# EAGLE schematic MT9V024 (EAGLE 9.1.2)
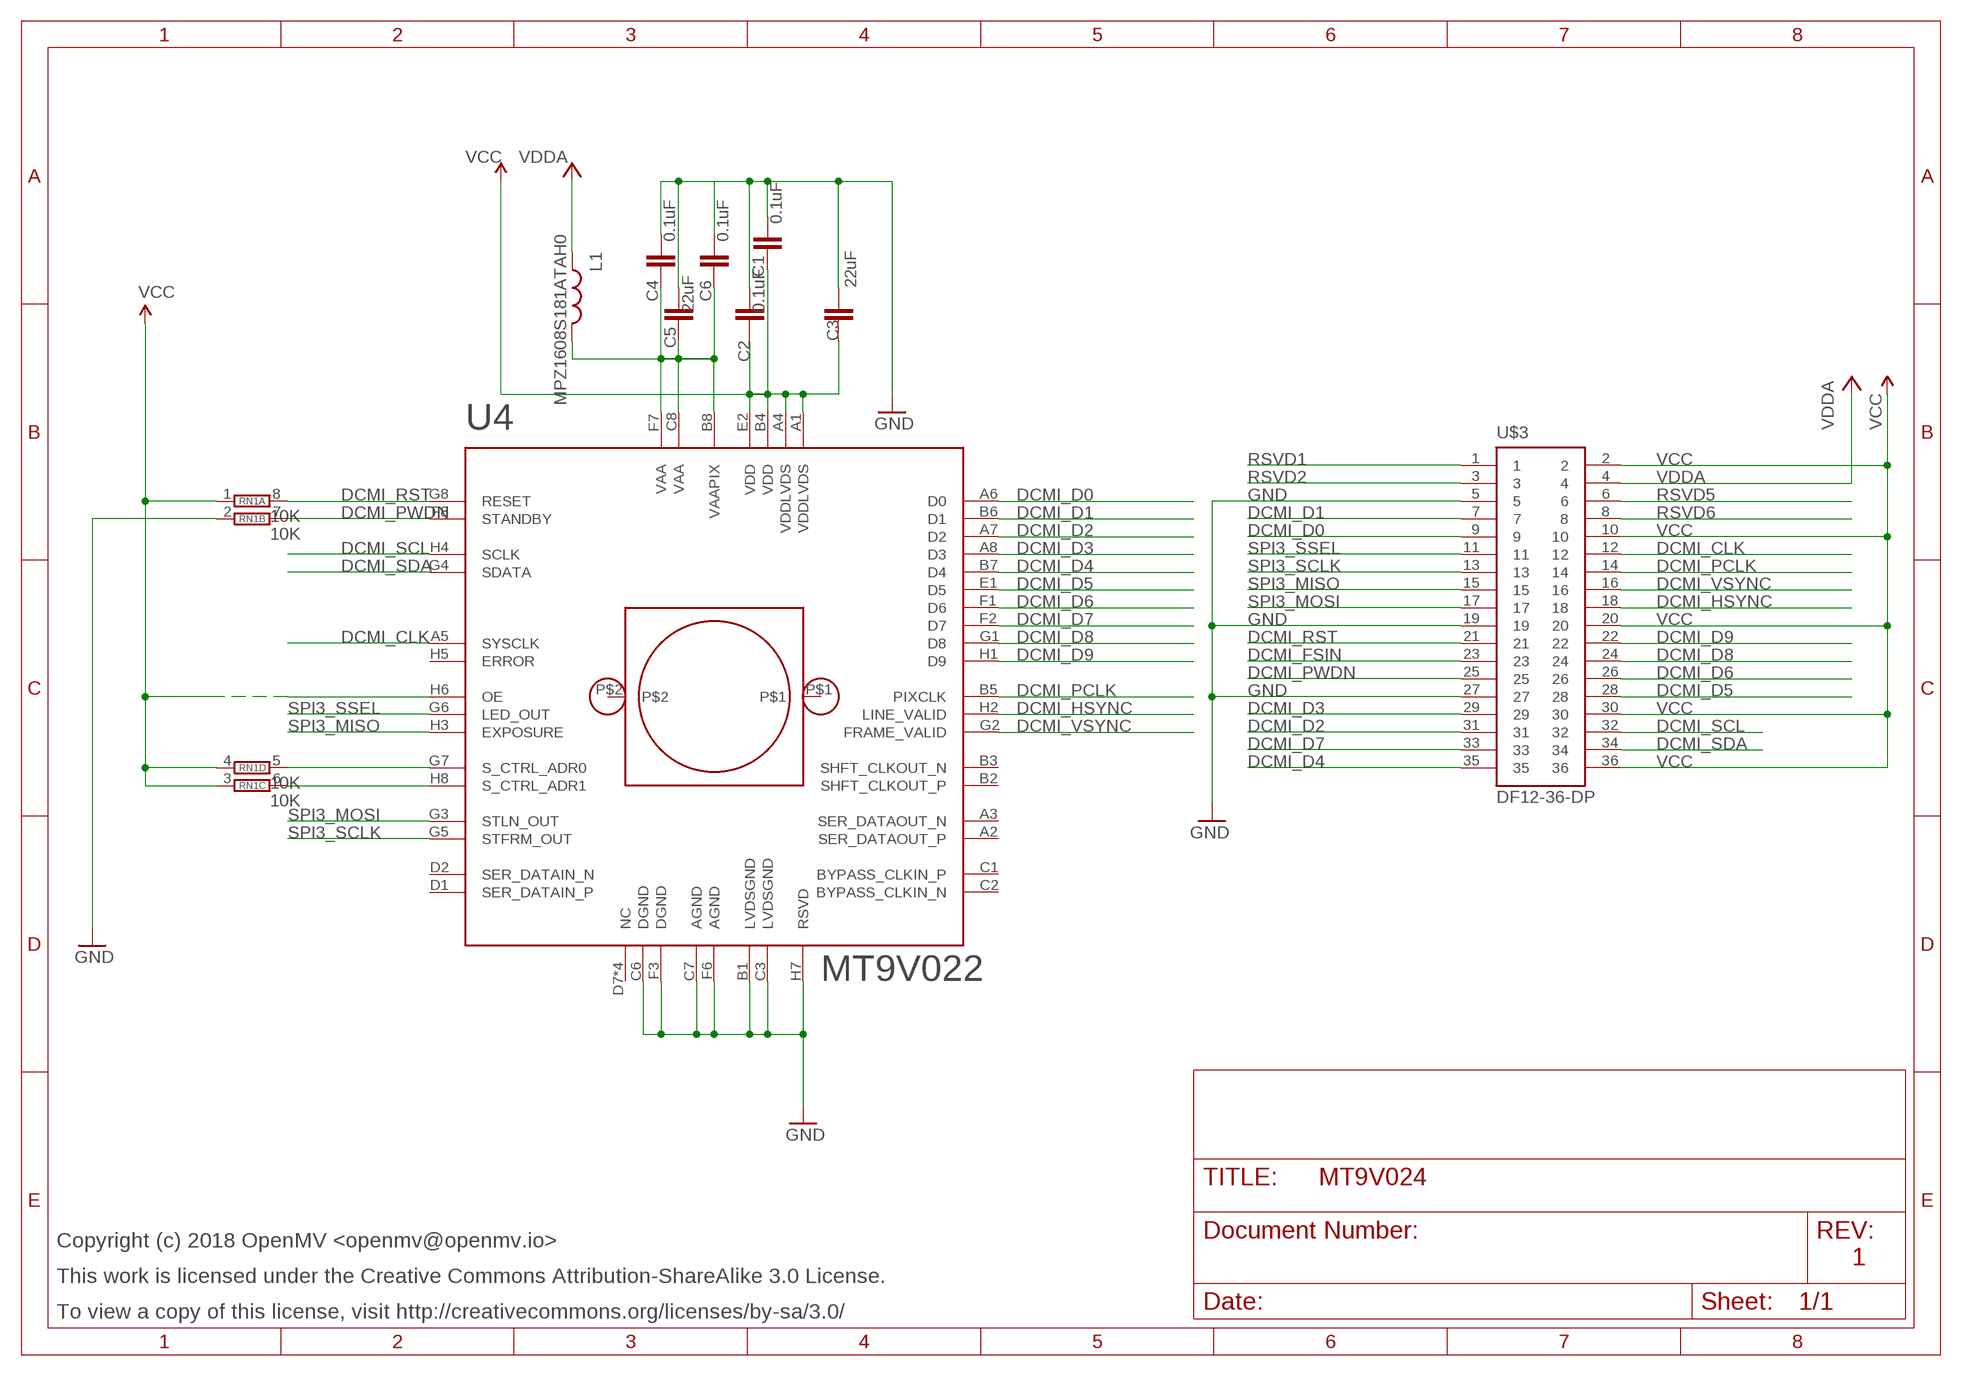
[diagram p0: schematic, sheet 1]

## Parts
C1  0.1uF  CAP0402-CAP  [0402-CAP]
C2  0.1uF  CAP0402-CAP  [0402-CAP]
C3  22uF  CAP0805  [0805]
C4  0.1uF  CAP0402-CAP  [0402-CAP]
C5  22uF  CAP0805  [0805]
C6  0.1uF  CAP0402-CAP  [0402-CAP]
L1  MPZ1608S181ATAH0  INDUCTOR0603  [0603]
LM1  LENSMOUNT20MM  [LENSMOUNT-20MM]
RN1  10K  4R-NEXBV8V  [EXBV8V]
U4  MT9V022  [IBGA52]
U$3  DF12-36-DP  [DF12-36-DP]

## Nets
DCMI_CLK: U4.A5(SYSCLK) U$3.12
DCMI_D0: U4.A6(D0) U$3.9
DCMI_D1: U4.B6(D1) U$3.7
DCMI_D2: U4.A7(D2) U$3.31
DCMI_D3: U4.A8(D3) U$3.29
DCMI_D4: U4.B7(D4) U$3.35
DCMI_D5: U4.E1(D5) U$3.28
DCMI_D6: U4.F1(D6) U$3.26
DCMI_D7: U4.F2(D7) U$3.33
DCMI_D8: U4.G1(D8) U$3.24
DCMI_D9: U4.H1(D9) U$3.22
DCMI_FSIN: U$3.23
DCMI_HSYNC: U4.H2(LINE_VALID) U$3.18
DCMI_PCLK: U4.B5(PIXCLK) U$3.14
DCMI_PWDN: RN1.7 U4.F8(STANDBY) U$3.25
DCMI_RST: RN1.8 U4.G8(RESET) U$3.21
DCMI_SCL: U4.H4(SCLK) U$3.32
DCMI_SDA: U4.G4(SDATA) U$3.34
DCMI_VSYNC: U4.G2(FRAME_VALID) U$3.16
GND: C1.2 C2.2 C3.1 C4.2 C5.1 C6.2 RN1.2 U4.B1(LVDSGND) U4.C3(LVDSGND) U4.C6(DGND) U4.C7(AGND) U4.F3(DGND) U4.F6(AGND) U4.H7(RSVD) U$3.5 U$3.19 U$3.27
N$19: RN1.5 U4.G7(S_CTRL_ADR0)
N$20: RN1.6 U4.H8(S_CTRL_ADR1)
RSVD1: U$3.1
RSVD2: U$3.3
RSVD5: U$3.6
RSVD6: U$3.8
SPI3_MISO: U4.H3(EXPOSURE) U$3.15
SPI3_MOSI: U4.G3(STLN_OUT) U$3.17
SPI3_SCLK: U4.G5(STFRM_OUT) U$3.13
SPI3_SSEL: U4.G6(LED_OUT) U$3.11
VAA: C4.1 C5.2 C6.1 L1.2 U4.B8(VAAPIX) U4.C8(VAA) U4.F7(VAA)
VCC: C1.1 C2.1 C3.2 RN1.1 RN1.3 RN1.4 U4.A1(VDDLVDS) U4.A4(VDDLVDS) U4.B4(VDD) U4.E2(VDD) U4.H6(OE) U$3.2 U$3.10 U$3.20 U$3.30 U$3.36
VDDA: L1.1 U$3.4
Unconnected: LM1.P$1 LM1.P$2 U4.A2(SER_DATAOUT_P) U4.A3(SER_DATAOUT_N) U4.B2(SHFT_CLKOUT_P) U4.B3(SHFT_CLKOUT_N) U4.C1(BYPASS_CLKIN_P) U4.C2(BYPASS_CLKIN_N) U4.D1(SER_DATAIN_P) U4.D2(SER_DATAIN_N) U4.D7(NC) U4.D8(NC) U4.E7(NC) U4.E8(NC) U4.H5(ERROR)

## Notes on the sheet
- Copyright (c) 2018 OpenMV <openmv@openmv.io>
- 1
- This work is licensed under the Creative Commons Attribution-ShareAlike 3.0 License.
- To view a copy of this license, visit http://creativecommons.org/licenses/by-sa/3.0/

## Library data of the parts
C1-C6 = sfe:CAP: Capacitor Standard 0603 ceramic capacitor, and 0.1" leaded capacitor.
L1 = sfe:INDUCTOR: Inductors Basic Inductor/Choke - 0603 and 1206. Footprints are not proven and vary greatly between part numbers.
LM1 = omnivision:LENSMOUNT
RN1 = resistor-dil:4R-N: Array Chip Resistor Source: RS Component / Phycomp; OC_FARNELL: unknown; OC_NEWARK: unknown
U4 = MT9V022:MT9V022
U$3 = DF12:DF12-36-DP